# EAGLE schematic shield (EAGLE 9.6.2)
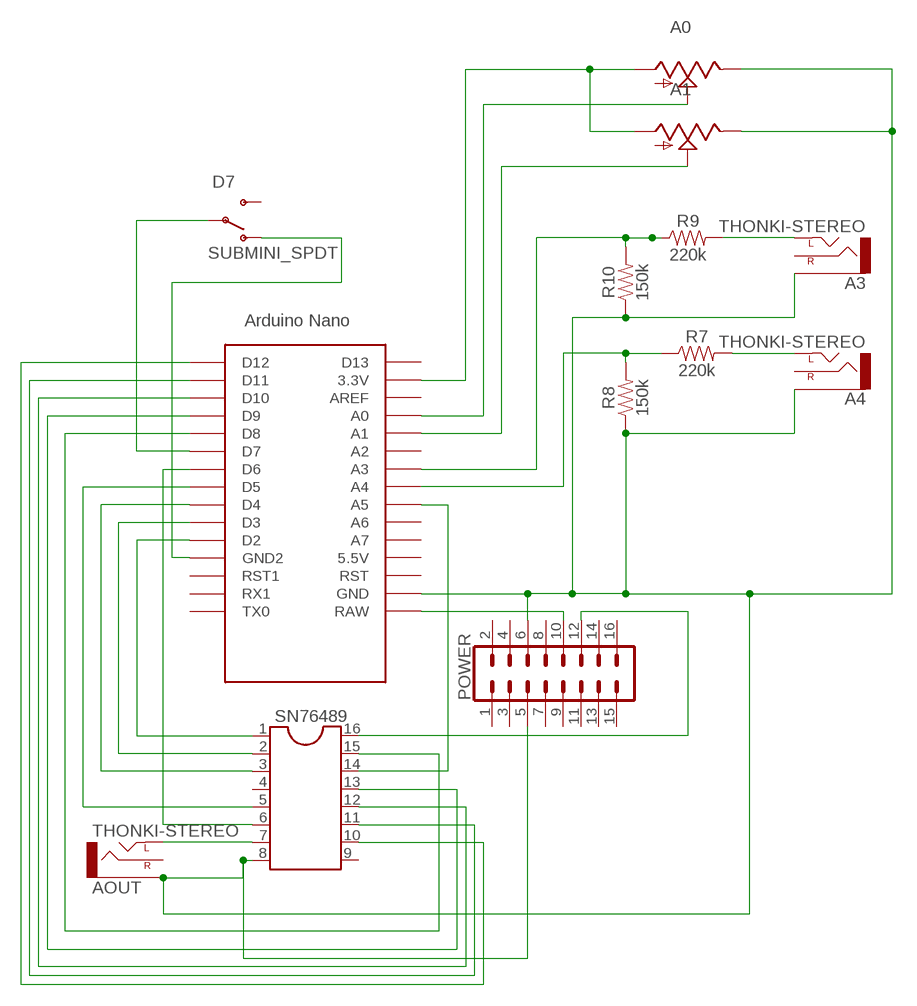
[diagram p0: schematic, sheet 1]

## Parts
A0  9MM_SNAP-IN_POT_  [9MM_SNAP-IN_POT]
A1  9MM_SNAP-IN_POT_  [9MM_SNAP-IN_POT]
A3  THONKI-STEREO  [WQP-PJ366ST_JACK]
A4  THONKI-STEREO  [WQP-PJ366ST_JACK]
AOUT  THONKI-STEREO  [WQP-PJ366ST_JACK]
D7  SUBMINI_SPDT  [SUBMINI_TOGGLE]
POWER  CONN_08X2  [2X8]
R7  220k  100KOHM-HORIZ_KIT-1/4W-1%  [AXIAL-0.3-KIT]
R8  150k  100KOHM-HORIZ_KIT-1/4W-1%  [AXIAL-0.3-KIT]
R9  220k  100KOHM-HORIZ_KIT-1/4W-1%  [AXIAL-0.3-KIT]
R10  150k  100KOHM-HORIZ_KIT-1/4W-1%  [AXIAL-0.3-KIT]
SN76489  DIL16  [DIL16]
U$1  NANO  [NANO]

## Nets
N$1: SN76489.14 U$1.A5
N$2: POWER.12 SN76489.16
N$3: A0.1(A) A1.1(A) U$1.3.3V
N$4: SN76489.5 U$1.D5
N$5: SN76489.6 U$1.D6
N$6: SN76489.3 U$1.D4
N$7: SN76489.1 U$1.D2
N$8: SN76489.2 U$1.D3
N$9: POWER.10 U$1.RAW
N$10: A3.P$1_TIP(LEFT) R9.P$2
N$13: AOUT.P$1_TIP(LEFT) SN76489.7
N$14: SN76489.10 U$1.D12
N$15: D7.1(O) U$1.GND1(GND2)
N$16: A0.2(S) U$1.A0
N$17: A1.2(S) U$1.A1
N$19: R9.P$1 R10.P$2 U$1.A3
N$20: A4.P$1_TIP(LEFT) R7.P$2
N$21: R7.P$1 R8.P$2 U$1.A4
N$23: D7.COM(COMMON) U$1.D7
N$24: A0.3(E) A1.3(E) A3.P$3_SLEEVE(SLEEVE) A4.P$3_SLEEVE(SLEEVE) AOUT.P$3_SLEEVE(SLEEVE) POWER.5 POWER.6 R8.P$1 R10.P$1 SN76489.8 U$1.GND
N$25: SN76489.11 U$1.D11
N$26: SN76489.13 U$1.D9
N$27: SN76489.15 U$1.D8
N$28: SN76489.12 U$1.D10
Unconnected: A3.P$2_SWITCH(RIGHT) A4.P$2_SWITCH(RIGHT) AOUT.P$2_SWITCH(RIGHT) D7.3(S) POWER.1 POWER.2 POWER.3 POWER.4 POWER.7 POWER.8 POWER.9 POWER.11 POWER.13 POWER.14 POWER.15 POWER.16 SN76489.4 SN76489.9 U$1.5V(5.5V) U$1.A2 U$1.A6 U$1.A7 U$1.AREF U$1.D13 U$1.ICSP1 U$1.ICSP2 U$1.ICSP3 U$1.ICSP4 U$1.ICSP5 U$1.ICSP6 U$1.RST U$1.RST1 U$1.RX1 U$1.TX0

## Library data of the parts
A0 A1 = MusicThingModular:9MM_SNAP-IN_POT: 9mm vertical snap-in pot, Alpha / Panasonic style
A3 A4 AOUT = MusicThingModular:THONKI-STEREO: 3.5mm socket for Eurorack modular synths
D7 = MusicThingModular:SUBMINI_SPDT
POWER = SparkFun-Connectors:CONN_08X2: Multi connection point. Often used as Generic Header-pin footprint for 0.1 inch spaced/style header connections You can populate with any combo of single row headers, but if you'd like an exact match, check this: Header - 2x8 (Male, 0.1") <https://www.sparkfun.com/products/13156> (PRT-13156) On any of the 0.1 inch spaced packages, you can populate with these: Break Away Headers - Straight <https://www.sparkfun.com/products/116> (PRT-00116) Break Away Male Headers - Right Angle <https://www.sparkfun.com/products/553> (PRT-00553) Female Headers <https://www.sparkfun.com/products/115> (PRT-00115) Break Away Headers - Machine Pin <https://www.sparkfun.com/products/117> (PRT-00117) Break Away Female Headers - Swiss Machine Pin <https://www.sparkfun.com/products/743> (PRT-00743)
R7-R10 = SparkFun-Resistors:100KOHM: 100kΩ resistor A resistor is a passive two-terminal electrical component that implements electrical resistance as a circuit element. Resistors act to reduce current flow, and, at the same time, act to lower voltage levels within circuits. - Wikipedia; PROD_ID: RES-12184; VALUE: 100k
SN76489 = ic-package:DIL16: Dual In Line / Socket
U$1 = Arduino-clone:NANO: Arduino Nano